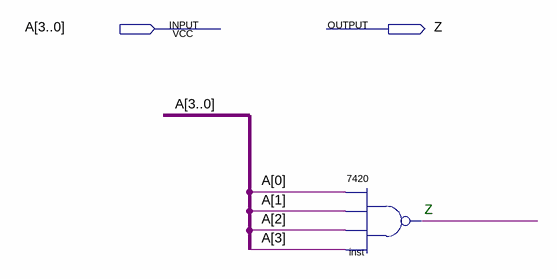
[diagram p0: schematic sheet]
// Quartus schematic nand_4in.bdf as structural Verilog: 1 symbols, 2 pins
module nand_4in (
  input  [3:0] A,
  output Z
);

  \7420  inst (.\4 (A[2]), .\2 (A[0]), .\3 (A[1]), .\5 (A[3]), .\1 (Z));

  // Notes on the sheet:
  //   Z
endmodule
